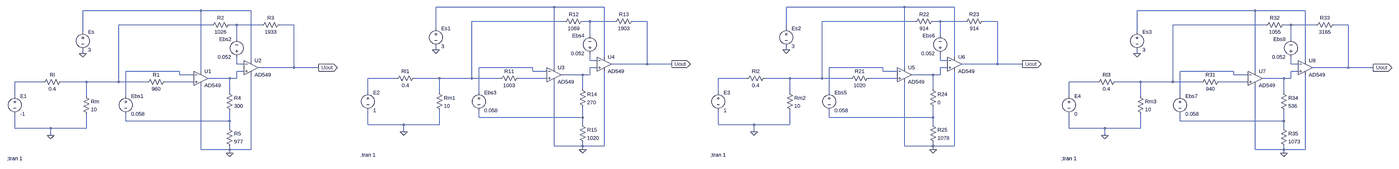
[diagram p0: schematic Draft1.asc, whole sheet]
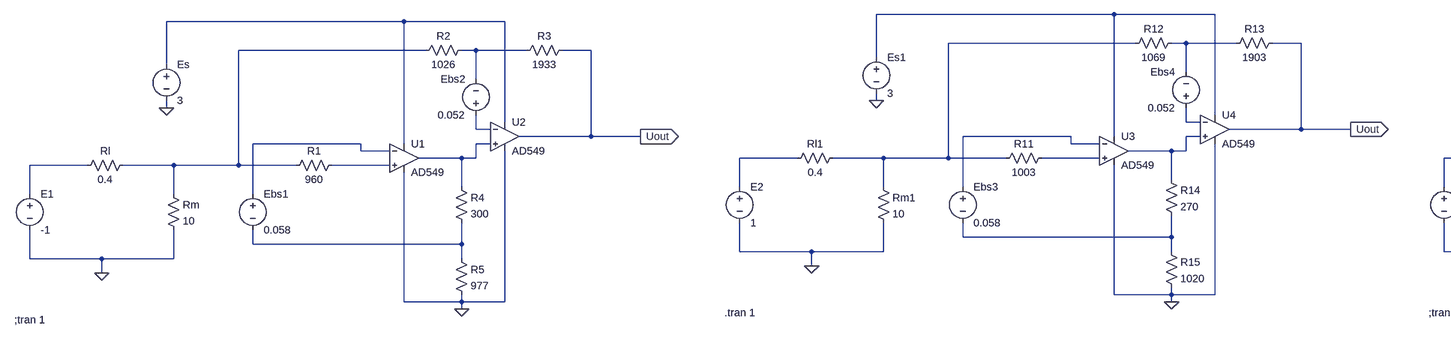
[diagram p1: schematic Draft1.asc, part, row 1 of 1, column 1 of 2]
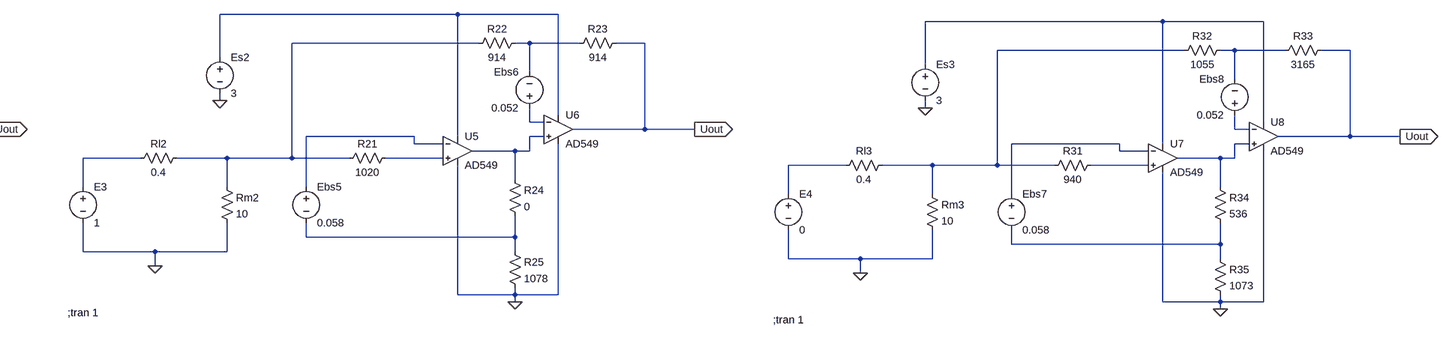
[diagram p2: schematic Draft1.asc, part, row 1 of 1, column 2 of 2]
Draft1.asc, the LTspice schematic file:
Version 4
SHEET 1 6180 760
WIRE 2352 64 1824 64
WIRE 2576 64 2352 64
WIRE 3936 64 3408 64
WIRE 4160 64 3936 64
WIRE 624 80 96 80
WIRE 848 80 624 80
WIRE 5520 80 4992 80
WIRE 5744 80 5520 80
WIRE 2400 128 1984 128
WIRE 2512 128 2480 128
WIRE 2624 128 2512 128
WIRE 2768 128 2704 128
WIRE 3984 128 3568 128
WIRE 4096 128 4064 128
WIRE 4208 128 4096 128
WIRE 4352 128 4288 128
WIRE 672 144 256 144
WIRE 784 144 752 144
WIRE 896 144 784 144
WIRE 1040 144 976 144
WIRE 5568 144 5152 144
WIRE 5680 144 5648 144
WIRE 5792 144 5680 144
WIRE 5936 144 5872 144
WIRE 1824 160 1824 64
WIRE 3408 160 3408 64
WIRE 96 176 96 80
WIRE 4992 176 4992 80
WIRE 2512 192 2512 128
WIRE 4096 192 4096 128
WIRE 784 208 784 144
WIRE 5680 208 5680 144
WIRE 1824 256 1824 240
WIRE 3408 256 3408 240
WIRE 96 272 96 256
WIRE 4992 272 4992 256
WIRE 2576 288 2576 64
WIRE 4160 288 4160 64
WIRE 848 304 848 80
WIRE 2512 304 2512 272
WIRE 2544 304 2512 304
WIRE 4096 304 4096 272
WIRE 4128 304 4096 304
WIRE 5744 304 5744 80
WIRE 784 320 784 288
WIRE 816 320 784 320
WIRE 2768 320 2768 128
WIRE 2768 320 2608 320
WIRE 2896 320 2768 320
WIRE 4352 320 4352 128
WIRE 4352 320 4192 320
WIRE 4480 320 4352 320
WIRE 5680 320 5680 288
WIRE 5712 320 5680 320
WIRE 1040 336 1040 144
WIRE 1040 336 880 336
WIRE 1168 336 1040 336
WIRE 2256 336 2016 336
WIRE 2352 336 2352 64
WIRE 2544 336 2512 336
WIRE 3840 336 3600 336
WIRE 3936 336 3936 64
WIRE 4128 336 4096 336
WIRE 5936 336 5936 144
WIRE 5936 336 5776 336
WIRE 6064 336 5936 336
WIRE 528 352 288 352
WIRE 624 352 624 80
WIRE 816 352 784 352
WIRE 2256 352 2256 336
WIRE 2320 352 2256 352
WIRE 3840 352 3840 336
WIRE 3904 352 3840 352
WIRE 5424 352 5184 352
WIRE 5520 352 5520 80
WIRE 5712 352 5680 352
WIRE 528 368 528 352
WIRE 592 368 528 368
WIRE 2480 368 2384 368
WIRE 2512 368 2512 336
WIRE 2512 368 2480 368
WIRE 4064 368 3968 368
WIRE 4096 368 4096 336
WIRE 4096 368 4064 368
WIRE 5424 368 5424 352
WIRE 5488 368 5424 368
WIRE 752 384 656 384
WIRE 784 384 784 352
WIRE 784 384 752 384
WIRE 1648 384 1520 384
WIRE 1840 384 1728 384
WIRE 1984 384 1984 128
WIRE 1984 384 1840 384
WIRE 2112 384 1984 384
WIRE 2320 384 2192 384
WIRE 3232 384 3104 384
WIRE 3424 384 3312 384
WIRE 3568 384 3568 128
WIRE 3568 384 3424 384
WIRE 3696 384 3568 384
WIRE 3904 384 3776 384
WIRE 5648 384 5552 384
WIRE 5680 384 5680 352
WIRE 5680 384 5648 384
WIRE -80 400 -208 400
WIRE 112 400 0 400
WIRE 256 400 256 144
WIRE 256 400 112 400
WIRE 384 400 256 400
WIRE 592 400 464 400
WIRE 4816 400 4688 400
WIRE 5008 400 4896 400
WIRE 5152 400 5152 144
WIRE 5152 400 5008 400
WIRE 5280 400 5152 400
WIRE 5488 400 5360 400
WIRE 2480 432 2480 368
WIRE 4064 432 4064 368
WIRE 752 448 752 384
WIRE 1520 448 1520 384
WIRE 1840 448 1840 384
WIRE 2016 448 2016 336
WIRE 3104 448 3104 384
WIRE 3424 448 3424 384
WIRE 3600 448 3600 336
WIRE 5648 448 5648 384
WIRE -208 464 -208 400
WIRE 112 464 112 400
WIRE 288 464 288 352
WIRE 4688 464 4688 400
WIRE 5008 464 5008 400
WIRE 5184 464 5184 352
WIRE 2016 560 2016 528
WIRE 2480 560 2480 512
WIRE 2480 560 2016 560
WIRE 3600 560 3600 528
WIRE 4064 560 4064 512
WIRE 4064 560 3600 560
WIRE 288 576 288 544
WIRE 752 576 752 528
WIRE 752 576 288 576
WIRE 5184 576 5184 544
WIRE 5648 576 5648 528
WIRE 5648 576 5184 576
WIRE 1520 592 1520 528
WIRE 1680 592 1520 592
WIRE 1840 592 1840 528
WIRE 1840 592 1680 592
WIRE 2480 592 2480 560
WIRE 3104 592 3104 528
WIRE 3264 592 3104 592
WIRE 3424 592 3424 528
WIRE 3424 592 3264 592
WIRE 4064 592 4064 560
WIRE -208 608 -208 544
WIRE -48 608 -208 608
WIRE 112 608 112 544
WIRE 112 608 -48 608
WIRE 752 608 752 576
WIRE 4688 608 4688 544
WIRE 4848 608 4688 608
WIRE 5008 608 5008 544
WIRE 5008 608 4848 608
WIRE 5648 608 5648 576
WIRE 1680 624 1680 592
WIRE 3264 624 3264 592
WIRE -48 640 -48 608
WIRE 4848 640 4848 608
WIRE 2352 688 2352 400
WIRE 2480 688 2480 672
WIRE 2480 688 2352 688
WIRE 2576 688 2576 352
WIRE 2576 688 2480 688
WIRE 3936 688 3936 400
WIRE 4064 688 4064 672
WIRE 4064 688 3936 688
WIRE 4160 688 4160 352
WIRE 4160 688 4064 688
WIRE 624 704 624 416
WIRE 752 704 752 688
WIRE 752 704 624 704
WIRE 848 704 848 368
WIRE 848 704 752 704
WIRE 2480 704 2480 688
WIRE 4064 704 4064 688
WIRE 5520 704 5520 416
WIRE 5648 704 5648 688
WIRE 5648 704 5520 704
WIRE 5744 704 5744 368
WIRE 5744 704 5648 704
WIRE 752 720 752 704
WIRE 5648 720 5648 704
FLAG -48 640 0
FLAG 96 272 0
FLAG 752 720 0
FLAG 1168 336 Uout
IOPIN 1168 336 Out
FLAG 1680 624 0
FLAG 1824 256 0
FLAG 2480 704 0
FLAG 2896 320 Uout
IOPIN 2896 320 Out
FLAG 3264 624 0
FLAG 3408 256 0
FLAG 4064 704 0
FLAG 4480 320 Uout
IOPIN 4480 320 Out
FLAG 4848 640 0
FLAG 4992 272 0
FLAG 5648 720 0
FLAG 6064 336 Uout
IOPIN 6064 336 Out
SYMBOL res 16 384 R90
WINDOW 0 0 56 VBottom 2
WINDOW 3 32 56 VTop 2
SYMATTR InstName Rl
SYMATTR Value 0.4
SYMBOL voltage -208 448 R0
SYMATTR InstName E1
SYMATTR Value -1
SYMBOL res 96 448 R0
SYMATTR InstName Rm
SYMATTR Value 10
SYMBOL res 480 384 R90
WINDOW 0 0 56 VBottom 2
WINDOW 3 32 56 VTop 2
SYMATTR InstName R1
SYMATTR Value 960
SYMBOL OpAmps\\AD549 624 320 R0
SYMATTR InstName U1
SYMBOL voltage 288 448 R0
SYMATTR InstName Ebs1
SYMATTR Value 0.058
SYMBOL voltage 96 160 R0
SYMATTR InstName Es
SYMATTR Value 3
SYMBOL res 768 128 R90
WINDOW 0 0 56 VBottom 2
WINDOW 3 32 56 VTop 2
SYMATTR InstName R2
SYMATTR Value 1026
SYMBOL voltage 784 304 R180
WINDOW 0 24 96 Left 2
WINDOW 3 24 16 Left 2
SYMATTR InstName Ebs2
SYMATTR Value 0.052
SYMBOL res 992 128 R90
WINDOW 0 0 56 VBottom 2
WINDOW 3 32 56 VTop 2
SYMATTR InstName R3
SYMATTR Value 1933
SYMBOL OpAmps\\AD549 848 272 R0
SYMATTR InstName U2
SYMBOL res 736 432 R0
SYMATTR InstName R4
SYMATTR Value 300
SYMBOL res 736 592 R0
SYMATTR InstName R5
SYMATTR Value 977
SYMBOL res 1744 368 R90
WINDOW 0 0 56 VBottom 2
WINDOW 3 32 56 VTop 2
SYMATTR InstName Rl1
SYMATTR Value 0.4
SYMBOL voltage 1520 432 R0
SYMATTR InstName E2
SYMATTR Value 1
SYMBOL res 1824 432 R0
SYMATTR InstName Rm1
SYMATTR Value 10
SYMBOL res 2208 368 R90
WINDOW 0 0 56 VBottom 2
WINDOW 3 32 56 VTop 2
SYMATTR InstName R11
SYMATTR Value 1003
SYMBOL OpAmps\\AD549 2352 304 R0
SYMATTR InstName U3
SYMBOL voltage 2016 432 R0
SYMATTR InstName Ebs3
SYMATTR Value 0.058
SYMBOL voltage 1824 144 R0
SYMATTR InstName Es1
SYMATTR Value 3
SYMBOL res 2496 112 R90
WINDOW 0 0 56 VBottom 2
WINDOW 3 32 56 VTop 2
SYMATTR InstName R12
SYMATTR Value 1069
SYMBOL voltage 2512 288 R180
WINDOW 0 24 96 Left 2
WINDOW 3 24 16 Left 2
SYMATTR InstName Ebs4
SYMATTR Value 0.052
SYMBOL res 2720 112 R90
WINDOW 0 0 56 VBottom 2
WINDOW 3 32 56 VTop 2
SYMATTR InstName R13
SYMATTR Value 1903
SYMBOL OpAmps\\AD549 2576 256 R0
SYMATTR InstName U4
SYMBOL res 2464 416 R0
SYMATTR InstName R14
SYMATTR Value 270
SYMBOL res 2464 576 R0
SYMATTR InstName R15
SYMATTR Value 1020
SYMBOL res 3328 368 R90
WINDOW 0 0 56 VBottom 2
WINDOW 3 32 56 VTop 2
SYMATTR InstName Rl2
SYMATTR Value 0.4
SYMBOL voltage 3104 432 R0
SYMATTR InstName E3
SYMATTR Value 1
SYMBOL res 3408 432 R0
SYMATTR InstName Rm2
SYMATTR Value 10
SYMBOL res 3792 368 R90
WINDOW 0 0 56 VBottom 2
WINDOW 3 32 56 VTop 2
SYMATTR InstName R21
SYMATTR Value 1020
SYMBOL OpAmps\\AD549 3936 304 R0
SYMATTR InstName U5
SYMBOL voltage 3600 432 R0
SYMATTR InstName Ebs5
SYMATTR Value 0.058
SYMBOL voltage 3408 144 R0
SYMATTR InstName Es2
SYMATTR Value 3
SYMBOL res 4080 112 R90
WINDOW 0 0 56 VBottom 2
WINDOW 3 32 56 VTop 2
SYMATTR InstName R22
SYMATTR Value 914
SYMBOL voltage 4096 288 R180
WINDOW 0 24 96 Left 2
WINDOW 3 24 16 Left 2
SYMATTR InstName Ebs6
SYMATTR Value 0.052
SYMBOL res 4304 112 R90
WINDOW 0 0 56 VBottom 2
WINDOW 3 32 56 VTop 2
SYMATTR InstName R23
SYMATTR Value 914
SYMBOL OpAmps\\AD549 4160 256 R0
SYMATTR InstName U6
SYMBOL res 4048 416 R0
SYMATTR InstName R24
SYMATTR Value 0
SYMBOL res 4048 576 R0
SYMATTR InstName R25
SYMATTR Value 1078
SYMBOL res 4912 384 R90
WINDOW 0 0 56 VBottom 2
WINDOW 3 32 56 VTop 2
SYMATTR InstName Rl3
SYMATTR Value 0.4
SYMBOL voltage 4688 448 R0
SYMATTR InstName E4
SYMATTR Value 0
SYMBOL res 4992 448 R0
SYMATTR InstName Rm3
SYMATTR Value 10
SYMBOL res 5376 384 R90
WINDOW 0 0 56 VBottom 2
WINDOW 3 32 56 VTop 2
SYMATTR InstName R31
SYMATTR Value 940
SYMBOL OpAmps\\AD549 5520 320 R0
SYMATTR InstName U7
SYMBOL voltage 5184 448 R0
SYMATTR InstName Ebs7
SYMATTR Value 0.058
SYMBOL voltage 4992 160 R0
SYMATTR InstName Es3
SYMATTR Value 3
SYMBOL res 5664 128 R90
WINDOW 0 0 56 VBottom 2
WINDOW 3 32 56 VTop 2
SYMATTR InstName R32
SYMATTR Value 1055
SYMBOL voltage 5680 304 R180
WINDOW 0 24 96 Left 2
WINDOW 3 24 16 Left 2
SYMATTR InstName Ebs8
SYMATTR Value 0.052
SYMBOL res 5888 128 R90
WINDOW 0 0 56 VBottom 2
WINDOW 3 32 56 VTop 2
SYMATTR InstName R33
SYMATTR Value 3165
SYMBOL OpAmps\\AD549 5744 272 R0
SYMATTR InstName U8
SYMBOL res 5632 432 R0
SYMATTR InstName R34
SYMATTR Value 536
SYMBOL res 5632 592 R0
SYMATTR InstName R35
SYMATTR Value 1073
TEXT -242 744 Left 2 !;tran 1
TEXT 1486 728 Left 2 !.tran 1
TEXT 3070 728 Left 2 !;tran 1
TEXT 4654 744 Left 2 !;tran 1

The netlist it stands for:
* Draft1.asc
Rl N009 N029 0.4
V§E1 N029 0 -1
Rm N009 0 10
R1 N030 N009 960
XU1 N030 N021 N003 0 N022 AD549  ; pins In+ In- V+ V- OUT
V§Ebs1 N021 N035 0.058
V§Es N003 0 3
R2 N010 N009 1026
V§Ebs2 N015 N010 0.052
R3 Uout N010 1933
XU2 N022 N015 N003 0 Uout AD549  ; pins In+ In- V+ V- OUT
R4 N022 N035 300
R5 N035 0 977
Rl1 N005 N025 0.4
V§E2 N025 0 1
Rm1 N005 0 10
R11 N026 N005 1003
XU3 N026 N017 N001 0 N018 AD549  ; pins In+ In- V+ V- OUT
V§Ebs3 N017 N033 0.058
V§Es1 N001 0 3
R12 N006 N005 1069
V§Ebs4 N013 N006 0.052
R13 Uout N006 1903
XU4 N018 N013 N001 0 Uout AD549  ; pins In+ In- V+ V- OUT
R14 N018 N033 270
R15 N033 0 1020
Rl2 N007 N027 0.4
V§E3 N027 0 1
Rm2 N007 0 10
R21 N028 N007 1020
XU5 N028 N019 N002 0 N020 AD549  ; pins In+ In- V+ V- OUT
V§Ebs5 N019 N034 0.058
V§Es2 N002 0 3
R22 N008 N007 914
V§Ebs6 N014 N008 0.052
R23 Uout N008 914
XU6 N020 N014 N002 0 Uout AD549  ; pins In+ In- V+ V- OUT
R24 N020 N034 0
R25 N034 0 1078
Rl3 N011 N031 0.4
V§E4 N031 0 0
Rm3 N011 0 10
R31 N032 N011 940
XU7 N032 N023 N004 0 N024 AD549  ; pins In+ In- V+ V- OUT
V§Ebs7 N023 N036 0.058
V§Es3 N004 0 3
R32 N012 N011 1055
V§Ebs8 N016 N012 0.052
R33 Uout N012 3165
XU8 N024 N016 N004 0 Uout AD549  ; pins In+ In- V+ V- OUT
R34 N024 N036 536
R35 N036 0 1073
;tran 1
.tran 1
;tran 1
;tran 1
.backanno
.end